# Altium schematic sheet main_connector.SchDoc
size A4
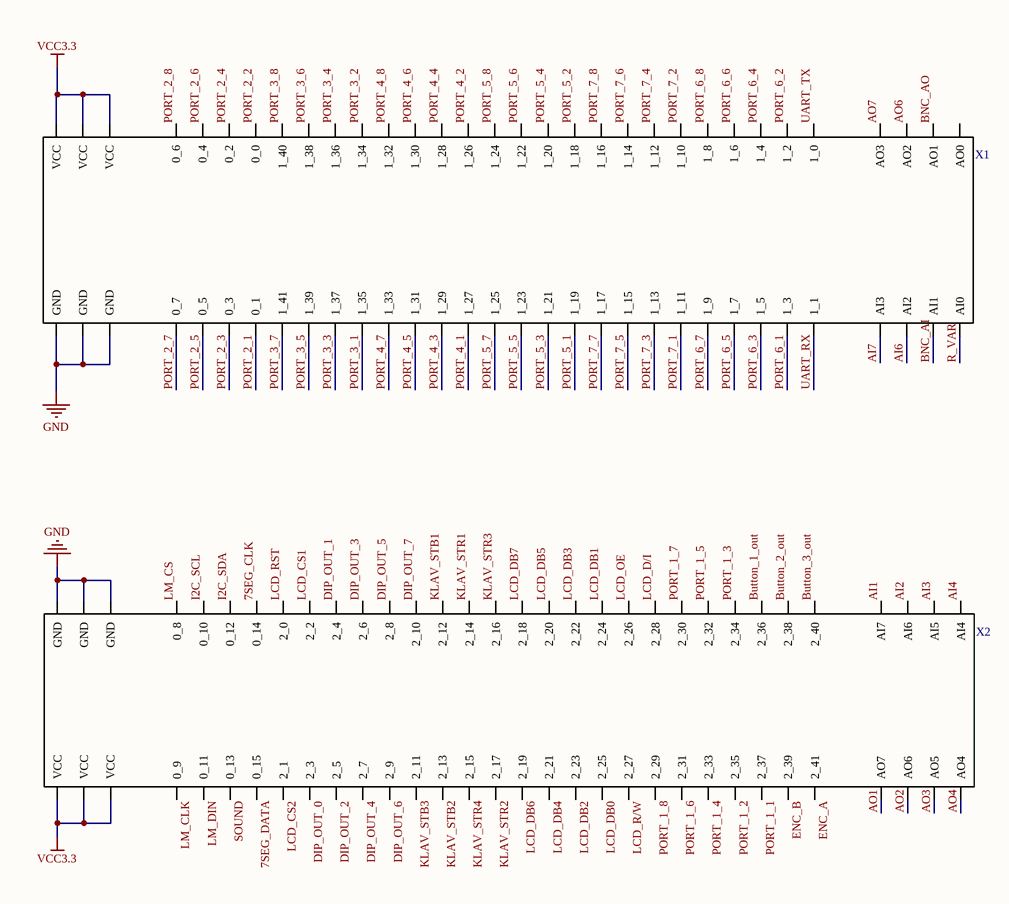
[diagram p0: main_connector.SchDoc]

## Parts
X1  CONNECTOR_TOP  [Connector]  (value not drawn)
X2  CONNECTOR_BOTTOM  [Connector]  (value not drawn)

## Nets
GND: X1.61(GND) X1.62(GND) X1.63(GND) X2.0(GND) X2.1(GND) X2.2(GND)
VCC3.3: X1.0(VCC) X1.1(VCC) X1.2(VCC) X2.61(VCC) X2.62(VCC) X2.63(VCC)
7SEG_CLK: X2.6(0_14)
7SEG_DATA: X2.57(0_15)
AI1: X2.28(AI7)
AI2: X2.29(AI6)
AI3: X2.30(AI5)
AI4: X2.31(AI4)
AI6: X1.34(AI2)
AI7: X1.35(AI3)
AO1: X2.35(AO7)
AO2: X2.34(AO6)
AO3: X2.33(AO5)
AO4: X2.32(AO4)
AO6: X1.29(AO2)
AO7: X1.28(AO3)
BNC_AI: X1.33(AI1)
BNC_AO: X1.30(AO1)
Button_1_out: X2.25(2_36)
Button_2_out: X2.26(2_38)
Button_3_out: X2.27(2_40)
DIP_OUT_0: X2.55(2_3)
DIP_OUT_1: X2.9(2_4)
DIP_OUT_2: X2.54(2_5)
DIP_OUT_3: X2.10(2_6)
DIP_OUT_4: X2.53(2_7)
DIP_OUT_5: X2.11(2_8)
DIP_OUT_6: X2.52(2_9)
DIP_OUT_7: X2.12(2_10)
ENC_A: X2.36(2_41)
ENC_B: X2.37(2_39)
I2C_SCL: X2.4(0_10)
I2C_SDA: X2.5(0_12)
KLAV_STB1: X2.13(2_12)
KLAV_STB2: X2.50(2_13)
KLAV_STB3: X2.51(2_11)
KLAV_STR1: X2.14(2_14)
KLAV_STR2: X2.48(2_17)
KLAV_STR3: X2.15(2_16)
KLAV_STR4: X2.49(2_15)
LCD_CS1: X2.8(2_2)
LCD_CS2: X2.56(2_1)
LCD_D/I: X2.21(2_28)
LCD_DB0: X2.44(2_25)
LCD_DB1: X2.19(2_24)
LCD_DB2: X2.45(2_23)
LCD_DB3: X2.18(2_22)
LCD_DB4: X2.46(2_21)
LCD_DB5: X2.17(2_20)
LCD_DB6: X2.47(2_19)
LCD_DB7: X2.16(2_18)
LCD_OE: X2.20(2_26)
LCD_R/W: X2.43(2_27)
LCD_RST: X2.7(2_0)
LM_CLK: X2.60(0_9)
LM_CS: X2.3(0_8)
LM_DIN: X2.59(0_11)
PORT_1_1: X2.38(2_37)
PORT_1_2: X2.39(2_35)
PORT_1_3: X2.24(2_34)
PORT_1_4: X2.40(2_33)
PORT_1_5: X2.23(2_32)
PORT_1_6: X2.41(2_31)
PORT_1_7: X2.22(2_30)
PORT_1_8: X2.42(2_29)
PORT_2_1: X1.57(0_1)
PORT_2_2: X1.6(0_0)
PORT_2_3: X1.58(0_3)
PORT_2_4: X1.5(0_2)
PORT_2_5: X1.59(0_5)
PORT_2_6: X1.4(0_4)
PORT_2_7: X1.60(0_7)
PORT_2_8: X1.3(0_6)
PORT_3_1: X1.53(1_35)
PORT_3_2: X1.10(1_34)
PORT_3_3: X1.54(1_37)
PORT_3_4: X1.9(1_36)
PORT_3_5: X1.55(1_39)
PORT_3_6: X1.8(1_38)
PORT_3_7: X1.56(1_41)
PORT_3_8: X1.7(1_40)
PORT_4_1: X1.49(1_27)
PORT_4_2: X1.14(1_26)
PORT_4_3: X1.50(1_29)
PORT_4_4: X1.13(1_28)
PORT_4_5: X1.51(1_31)
PORT_4_6: X1.12(1_30)
PORT_4_7: X1.52(1_33)
PORT_4_8: X1.11(1_32)
PORT_5_1: X1.45(1_19)
PORT_5_2: X1.18(1_18)
PORT_5_3: X1.46(1_21)
PORT_5_4: X1.17(1_20)
PORT_5_5: X1.47(1_23)
PORT_5_6: X1.16(1_22)
PORT_5_7: X1.48(1_25)
PORT_5_8: X1.15(1_24)
PORT_6_1: X1.37(1_3)
PORT_6_2: X1.26(1_2)
PORT_6_3: X1.38(1_5)
PORT_6_4: X1.25(1_4)
PORT_6_5: X1.39(1_7)
PORT_6_6: X1.24(1_6)
PORT_6_7: X1.40(1_9)
PORT_6_8: X1.23(1_8)
PORT_7_1: X1.41(1_11)
PORT_7_2: X1.22(1_10)
PORT_7_3: X1.42(1_13)
PORT_7_4: X1.21(1_12)
PORT_7_5: X1.43(1_15)
PORT_7_6: X1.20(1_14)
PORT_7_7: X1.44(1_17)
PORT_7_8: X1.19(1_16)
R_VAR: X1.32(AI0)
SOUND: X2.58(0_13)
UART_RX: X1.36(1_1)
UART_TX: X1.27(1_0)

Not connected (* = marked no-connect by the designer): X1 31(AO0)

## Library data of the parts
X1 = CONNECTOR_TOP: control board connector
X2 = CONNECTOR_BOTTOM: control board connector